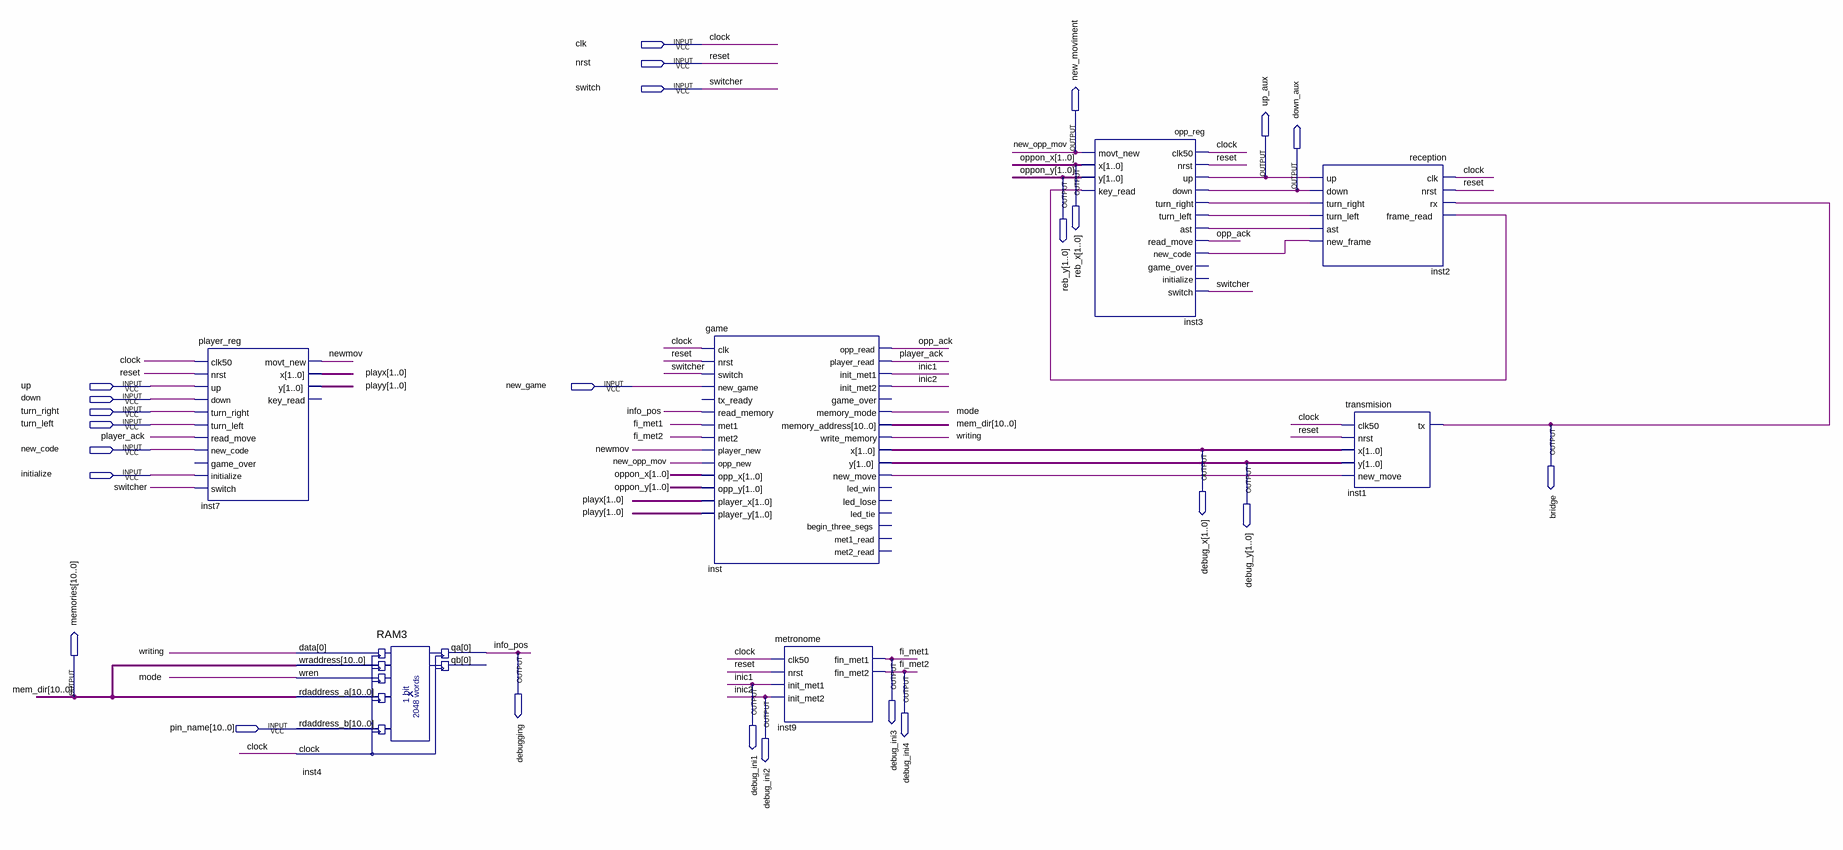
[diagram p0: schematic sheet]
// Quartus schematic testing.bdf as structural Verilog: 7 symbols, 25 pins
module testing (
  input  clk,
  input  nrst,
  input  switch,
  input  up,
  input  new_game,
  input  down,
  input  turn_right,
  input  turn_left,
  input  new_code,
  input  initialize,
  input  [10:0] pin_name,
  output new_moviment,
  output [1:0] reb_x,
  output [1:0] reb_y,
  output up_aux,
  output down_aux,
  output bridge,
  output [1:0] debug_x,
  output [1:0] debug_y,
  output debugging,
  output debug_ini3,
  output debug_ini4,
  output debug_ini1,
  output [10:0] memories,
  output debug_ini2
);

  wire inst2_ast, inst2_new_frame, inst2_turn_left, inst2_turn_right, inst3_key_read, inst_new_move, mode,
       newmov, opp_ack, player_ack, writing;
  wire [1:0] playx, playy;

  player_reg inst7 (
    .clk50(clk), .nrst(nrst), .up(up), .down(down), .turn_right(turn_right), .turn_left(turn_left),
    .read_move(player_ack), .new_code(new_code), .initialize(initialize), .switch(switch), .movt_new(newmov),
    .x(playx), .y(playy));  // open: game_over, key_read
  RAM3 inst4 (
    .data(writing), .wraddress(memories), .wren(mode), .rdaddress_a(memories), .rdaddress_b(pin_name),
    .clock(clk), .qa(debugging));  // open: qb
  game inst (
    .clk(clk), .nrst(nrst), .switch(switch), .new_game(new_game), .read_memory(debugging), .met1(debug_ini3),
    .met2(debug_ini4), .player_new(newmov), .opp_new(new_moviment), .opp_x(reb_x), .opp_y(reb_y),
    .player_x(playx), .player_y(playy), .opp_read(opp_ack), .player_read(player_ack), .init_met1(debug_ini1),
    .init_met2(debug_ini2), .memory_mode(mode), .memory_address(memories), .write_memory(writing),
    .x(debug_x), .y(debug_y), .new_move(inst_new_move));  // open: tx_ready, game_over, led_win, led_lose, led_tie, begin_three_segs, met1_read, met2_read
  metronome inst9 (
    .clk50(clk), .nrst(nrst), .init_met1(debug_ini1), .init_met2(debug_ini2), .fin_met1(debug_ini3),
    .fin_met2(debug_ini4));
  opp_reg inst3 (
    .clk50(clk), .nrst(nrst), .up(up_aux), .down(down_aux), .turn_right(inst2_turn_right),
    .turn_left(inst2_turn_left), .ast(inst2_ast), .read_move(opp_ack), .new_code(inst2_new_frame),
    .switch(switch), .movt_new(new_moviment), .x(reb_x), .y(reb_y), .key_read(inst3_key_read));  // open: game_over, initialize
  reception inst2 (
    .clk(clk), .nrst(nrst), .rx(bridge), .frame_read(inst3_key_read), .up(up_aux), .down(down_aux),
    .turn_right(inst2_turn_right), .turn_left(inst2_turn_left), .ast(inst2_ast), .new_frame(inst2_new_frame));
  transmision inst1 (.clk50(clk), .nrst(nrst), .new_move(inst_new_move), .x(debug_x), .y(debug_y), .tx(bridge));

  // Other names for the same wires on the sheet: clock = clk; fi_met1 = debug_ini3; fi_met2 = debug_ini4;
  //   info_pos = debugging; inic1 = debug_ini1; inic2 = debug_ini2; mem_dir[10:0] = memories;
  //   new_opp_mov = new_moviment; oppon_x[1:0] = reb_x; oppon_y[1:0] = reb_y; reset = nrst; switcher = switch
endmodule
